# EAGLE design Stroomtrekker (EAGLE 9.5.0)
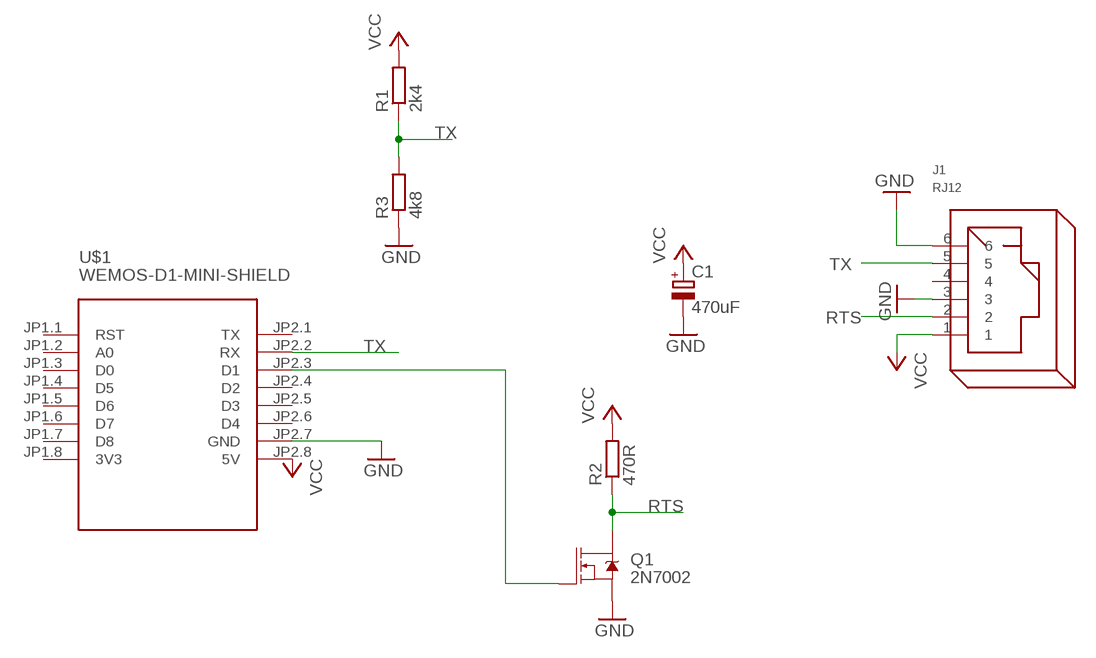
[diagram p0: schematic, sheet 1]

## Parts
C1  470uF  CPOL-EUE2.5-6  [E2,5-6]
J1  RJ12  [RJ12]
Q1  2N7002  MOSFET-NCH-2N7002PW  [SOT323]
R1  2k4  R-EU_R0805  [R0805]
R2  470R  R-EU_R0805  [R0805]
R3  4k8  R-EU_R0805  [R0805]
U$1  WEMOS-D1-MINI-SHIELD  [WEMOS-D1-MINI-SHIELD]

## Nets
GND: C1.- J1.3 J1.6 Q1.2(S) R3.1 U$1.JP2.7(GND)
N$1: Q1.1(G) U$1.JP2.3(D1)
RTS: J1.2 Q1.3(D) R2.1
TX: J1.5 R1.1 R3.2 U$1.JP2.2(RX)
VCC: C1.+ J1.1 R1.2 R2.2 U$1.JP2.8(5V)
Unconnected: J1.4 U$1.JP1.1(RST) U$1.JP1.2(A0) U$1.JP1.3(D0) U$1.JP1.4(D5) U$1.JP1.5(D6) U$1.JP1.6(D7) U$1.JP1.7(D8) U$1.JP2.1(TX) U$1.JP2.4(D2) U$1.JP2.5(D3) U$1.JP2.6(D4)

## Power pins joined to a net without a drawn wire
3V3: U$1.JP1.8(3V3)

## Library data of the parts
C1 = rcl:CPOL-EU: POLARIZED CAPACITOR, European symbol; SPICEPREFIX: C
J1 = con-rj:RJ12: RJ12, RJ14 and RJ25 RJ12, RJ14 and RJ25 jacks side mounted http://www.tycoelectronics.com
Q1 = SparkFun-DiscreteSemi:MOSFET-NCH: N-channel MOSFETs Voltage controlled devices that allow control of high current outputs. SparkFun Products: SparkFun OpenScale <https://www.sparkfun.com/products/13261> SparkFun Digital Sandbox <https://www.sparkfun.com/products/12651> SparkFun Monster Moto Shield <https://www.sparkfun.com/products/10182> SparkFun MOSFET Power Controller <https://www.sparkfun.com/products/11214>; PROD_ID: TRANS-11151; VALUE: 310mA/60V/1.6Ω
R1-R3 = rcl:R-EU_: RESISTOR, European symbol; SPICEPREFIX: R
U$1 = diy-modules (1):WEMOS-D1-MINI-SHIELD: Template for WEMOS D1 mini compatible shields NOTICE: This is a template only. You can use it as a base to create symbols for WEMOS D1 mini compatible shields. Official list of available shields can be found here: https://www.wemos.cc/D1-mini-Shields

## Board
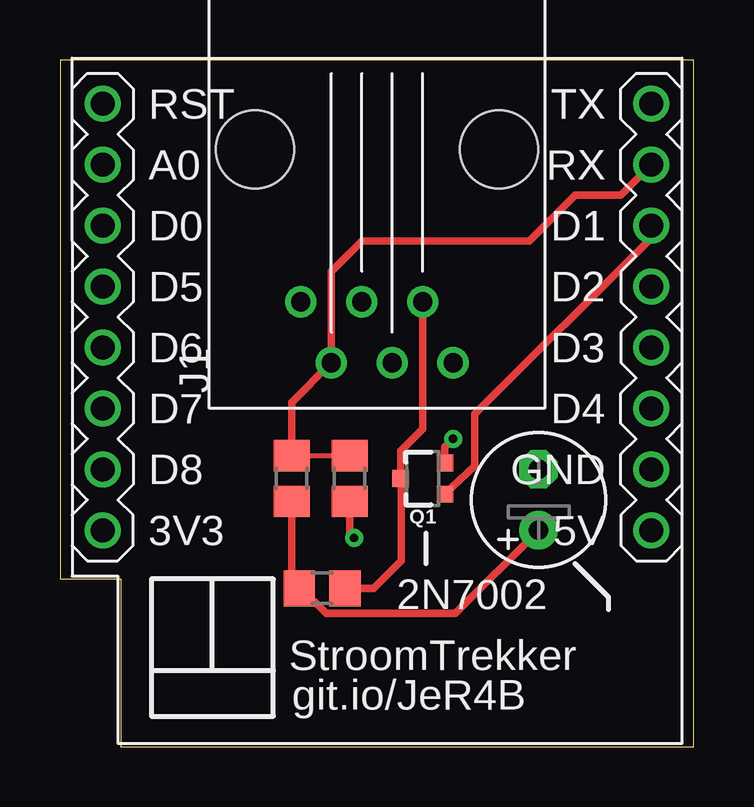
[diagram p1: board, top side]
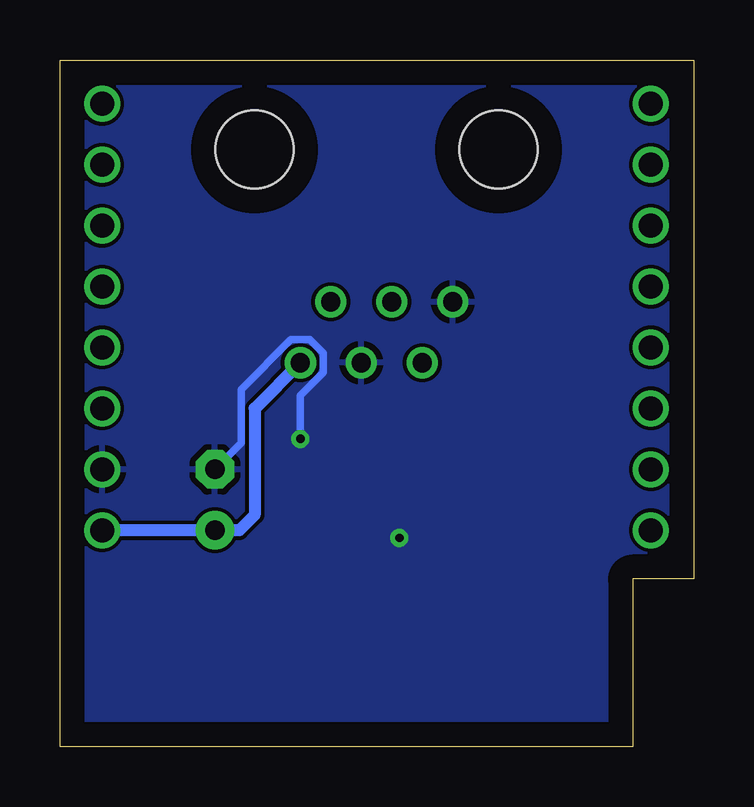
[diagram p2: board, bottom side, seen from below]

Size 26.4 x 28.63 mm. Coordinates in mm from the lower left corner, seen from the top.
Outline: 2.54,0 26.4,0 26.4,28.63 0,28.63 0,6.99 2.54,6.99 2.54,0
Copper layers (1*16): Top 0.035mm / dielectric 0.15mm / Bottom 0.035mm
Design rules "default": minimum track width 6mil, minimum drill 0.35mm, track to track 6mil, track to pad 6mil, pad to pad 6mil, via to via 6mil, smd to smd 6mil, copper to edge 40mil, drill to drill 6mil, minimum pad ring 10mil, minimum via ring 8mil, stop-mask expansion 4mil, vias tented up to drill 0mil, thermal gap 10mil

### Footprints (pad centres in the part's own frame; a part is rotated, then mirrored left to right if it is on the bottom)
E2,5-6 = drill 0.813 pad 1.6: + -1.27,0 | drill 0.813 pad 1.6 octagon: - 1.27,0
RJ12 = drill 0.8: 1 -8.89,-3.175; 2 -6.35,-1.905; 3 -8.89,-0.635; 4 -6.35,0.635; 5 -8.89,1.905; 6 -6.35,3.175 | hole 3.25: 0,-5.08; 0,5.08
SOT323 = smd 0.7 x 0.7: 1 -0.65,-0.925; 2 0.65,-0.925; 3 0,0.925
R0805 = smd 1.3 x 1.5: 1 -0.95,0; 2 0.95,0
WEMOS-D1-MINI-SHIELD = drill 1: JP1.1 -11.43,12.065; JP1.2 -11.43,9.525; JP1.3 -11.43,6.985; JP1.4 -11.43,4.445; JP1.5 -11.43,1.905; JP1.6 -11.43,-0.635; JP1.7 -11.43,-3.175; JP1.8 -11.43,-5.715; JP2.1 11.43,12.065; JP2.2 11.43,9.525; JP2.3 11.43,6.985; JP2.4 11.43,4.445; JP2.5 11.43,1.905; JP2.6 11.43,-0.635; JP2.7 11.43,-3.175; JP2.8 11.43,-5.715

### Placement (x,y rotation side)
C1  19.94,10.29 90 top
J1  13.21,24.89 90 top
Q1  15.11,11.18 90 top
R1  9.65,11.18 270 top
R2  10.92,6.6 180 top
R3  12.06,11.18 90 top
U$1  13.21,14.73 0 top

### Tracks (layer width: path | path; a pad name or v marks a point on that pad's centre or on a via)
GND  (via drill 0.35)
  Top 0.305: Q1.2 16.04,12.48 v16.38,12.83 | R3.1 12.06,8.76 12.13,8.7 v12.26,8.7
  Bottom 0.305: C1.- 18.85,12.65 18.85,14.89 16.78,16.96 15.99,16.96 15.42,16.4 15.42,15.61 16.38,14.65 v16.38,12.83
  pour Bottom: 0.51,28.7 0.51,-0.51 25.91,-0.51 25.91,28.7
N$1
  Top 0.305: Q1.1 17.29,11.69 17.29,13.86 24.64,21.21 U$1.JP2.3
RTS
  Top 0.305: J1.2 15.11,13.25 14.19,12.32 14.19,11.3 Q1.3 14.22,11.14 14.22,7.75 13.08,6.6 R2.1
TX
  Top 0.203: R3.2 R1.1
  Top 0.305: R1.1 9.65,14.35 J1.5 11.3,19.81 12.57,21.08 19.56,21.08 21.46,22.99 23.37,22.99 U$1.JP2.2
VCC
  Top 0.305: R1.2 9.65,6.92 R2.2 10.04,6.6 11.1,5.55 16.47,5.55 C1.+
  Bottom 0.508: J1.1 18.29,14.1 18.29,9.65 18.92,9.02 C1.+ U$1.JP2.8

### Text on the board
tPlace: 2N7002 | StroomTrekker | git.io/JeR4B